# Altium project ac_rc_unit.PrjPcb
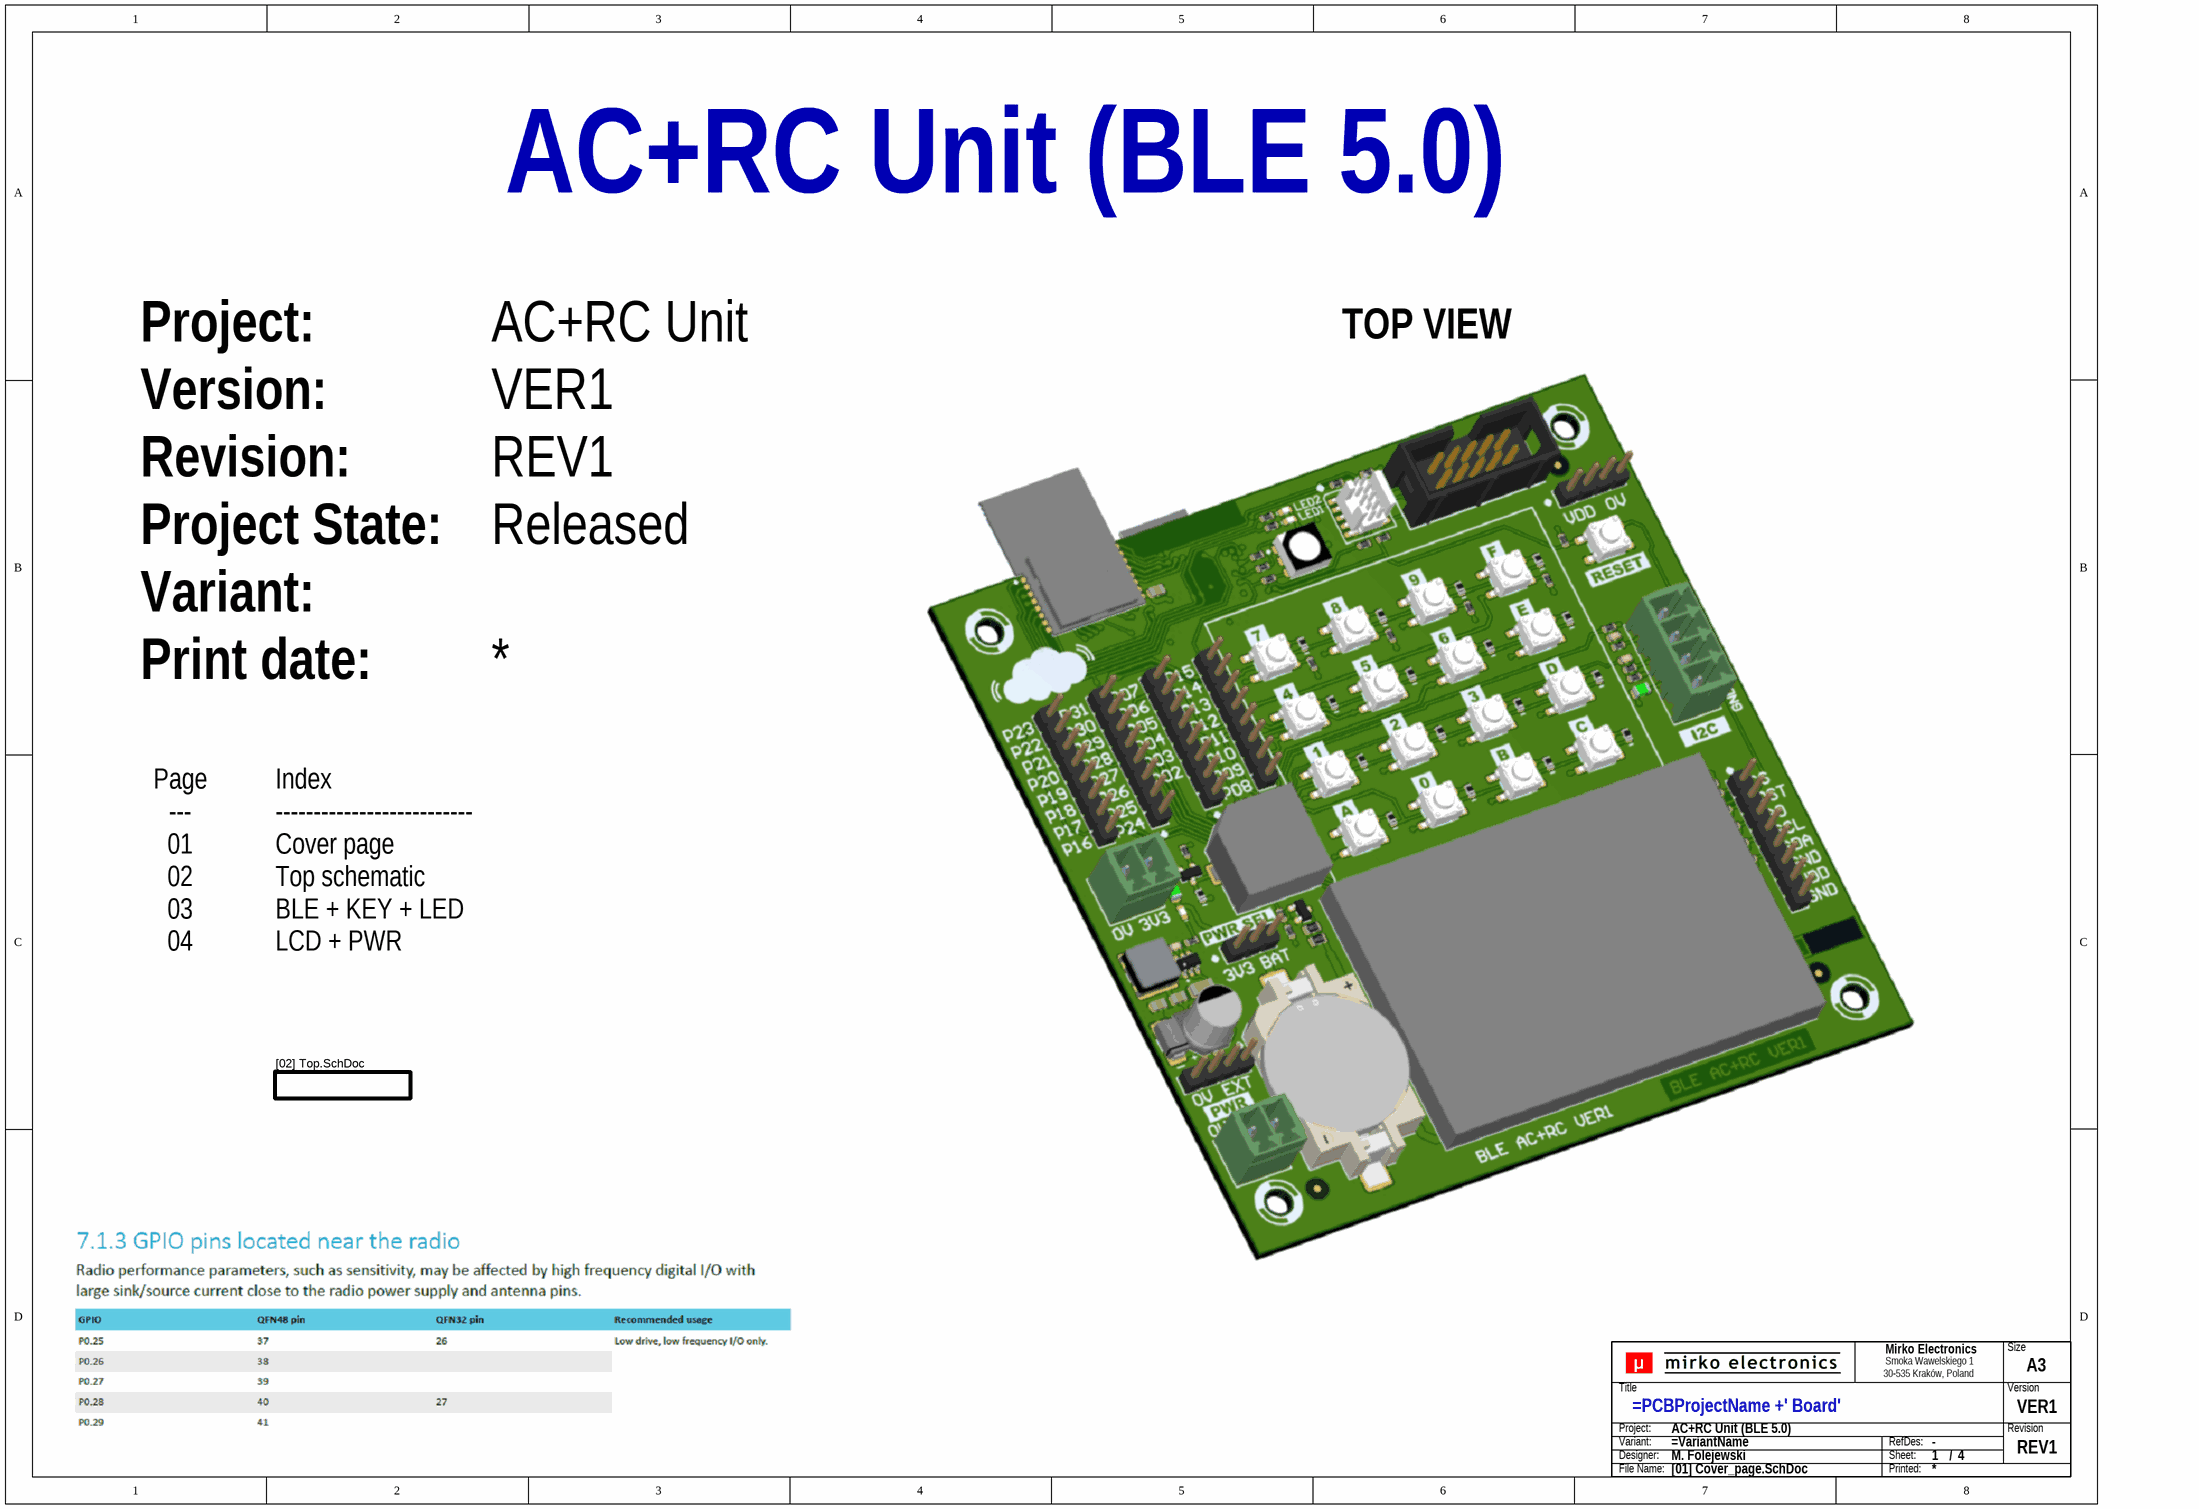
[diagram p0: [01] Cover_page.SchDoc]
GlobalProjectName: AC+RC Unit; GlobalProjectNumber: 2019upwork005; OutputFileNamePrefix: ac_rc_unit_VER1; PCBBoardName: AC+RC Unit; PCBProjectName: AC+RC Unit (BLE 5.0); SchPcbReleaseState: Released; SchPcbRevision: REV1; SchPcbVersion: VER1
4 sheets, 129 parts. Net scope: flat (ports and power ports of the same name join across sheets).
Board file: ac_rc_unit_VER1.PcbDoc
Sheets:
  [01] Cover_page.SchDoc
    D8 = [02] Top.SchDoc
      D7 = [03] BLE_KEY_LED.SchDoc
      D8 = [04] LCD_PWR.SchDoc

## Sheet [01] Cover_page.SchDoc: =PCBProjectName +' Board'
size A3; Engineer: M. Folejewski; DocumentNumber: 1; SheetNumber: 1; SheetTotal: 4; Designators: -; PageSize: A3

### Parts
(Parts that share a designator on the sheet are numbered #1, #2 ... from top to bottom, then left to right.)
TB?#1  Title block  (value not drawn)  (graphical)

### Sub-sheets
D8 = [02] Top.SchDoc: no entries

### Notes on the sheet
- Project:
- TOP VIEW
- Version:
- Revision:
- Project State:
- Variant:
- Print date:
- Page
  ---
  01
  02
  03
  04
- Index
  --------------------------
  Cover page
  Top schematic
  BLE + KEY + LED
  LCD + PWR
- (in symbol SCH_TITLE_BLOCK_V1) Mirko Electronics; Size; Smoka Wawelskiego 1; 30-535 Kraków, Poland; Title; Version; Project:; Revision; Variant:; RefDes:; Designer:; Sheet:; /; File Name:; Printed:

### Library data of the parts
TB?#1 = SCH_TITLE_BLOCK_V1: Component Type: Title block; Manufacturer: -; Mounting Type: Non component; MPN: -; Operating Temperature: -; Package: -; Specification: Title block; Value: Title block; Replacement: -; System: ?

## Sheet [02] Top.SchDoc: Top schematic
size A3; Engineer: M. Folejewski; DocumentNumber: 2; SheetNumber: 2; SheetTotal: 4; PageSize: A3; Designators: 1-99
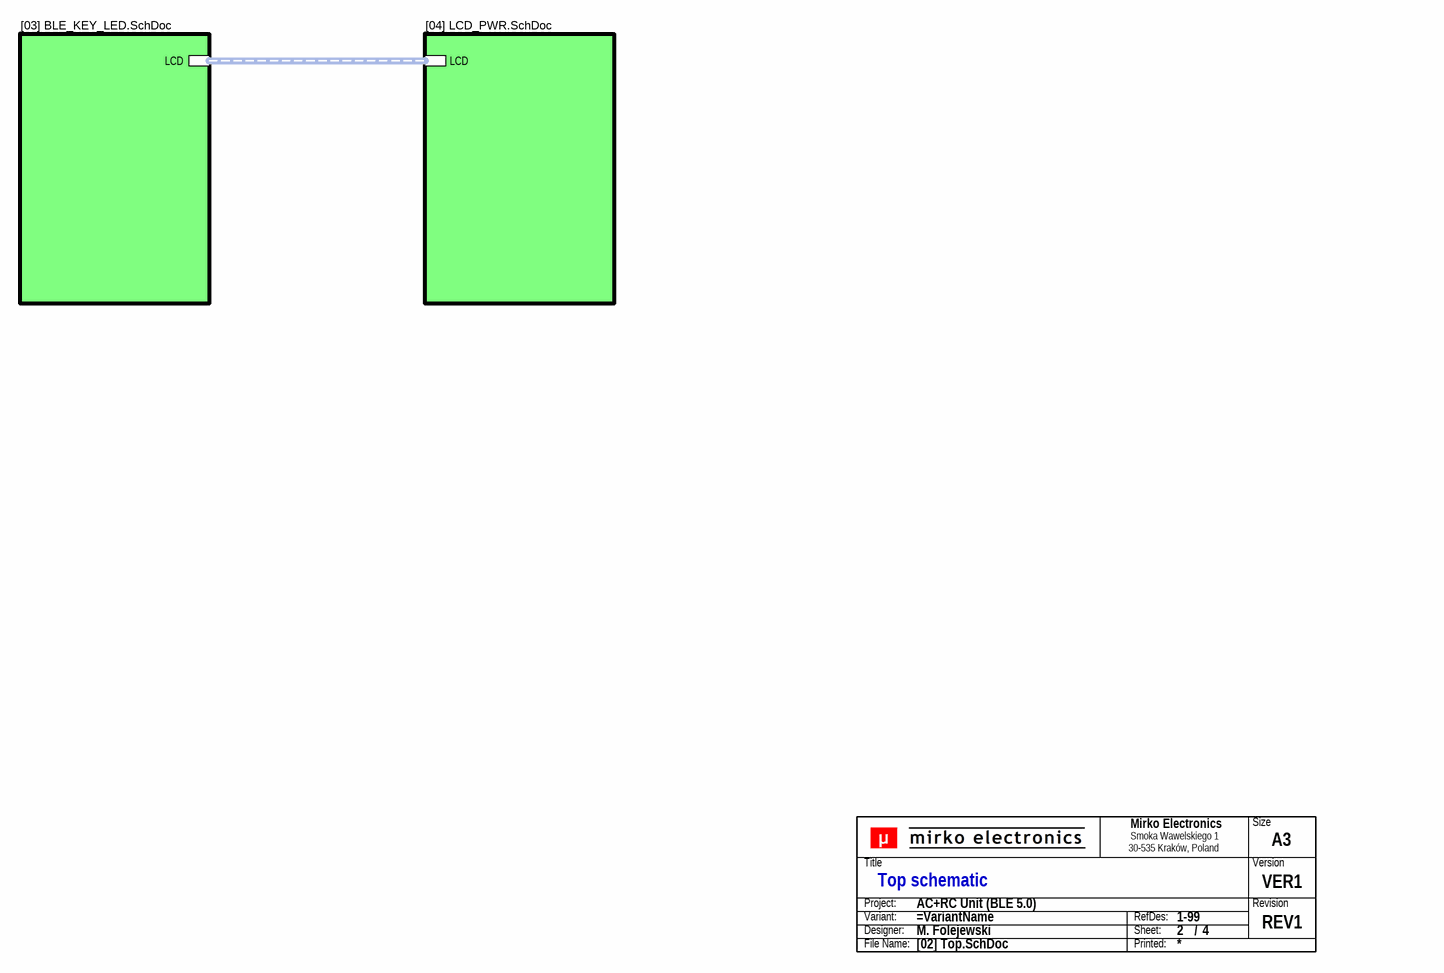
[diagram p1: [02] Top.SchDoc]

### Parts
(Parts that share a designator on the sheet are numbered #1, #2 ... from top to bottom, then left to right.)
TB?#2  Title block  (value not drawn)  (graphical)

### Sub-sheets
D7 = [03] BLE_KEY_LED.SchDoc: LCD (harness LCD)
D8 = [04] LCD_PWR.SchDoc: LCD (harness LCD)

### Buses and harness runs
harness sheet D7/LCD = sheet D8/LCD

### Notes on the sheet
- (in symbol SCH_TITLE_BLOCK_V1) Mirko Electronics; Size; Smoka Wawelskiego 1; 30-535 Kraków, Poland; Title; Version; Project:; Revision; Variant:; RefDes:; Designer:; Sheet:; /; File Name:; Printed:

### Library data of the parts
TB?#2 = SCH_TITLE_BLOCK_V1: Component Type: Title block; Manufacturer: -; Mounting Type: Non component; MPN: -; Operating Temperature: -; Package: -; Specification: Title block; Value: Title block; Replacement: -; System: ?

## Sheet [03] BLE_KEY_LED.SchDoc: BLE module, LEDs, keypad, buzzer
size A3; Engineer: M. Folejewski; DocumentNumber: 3; SheetNumber: 3; SheetTotal: 4; PageSize: A3; Designators: 1-99
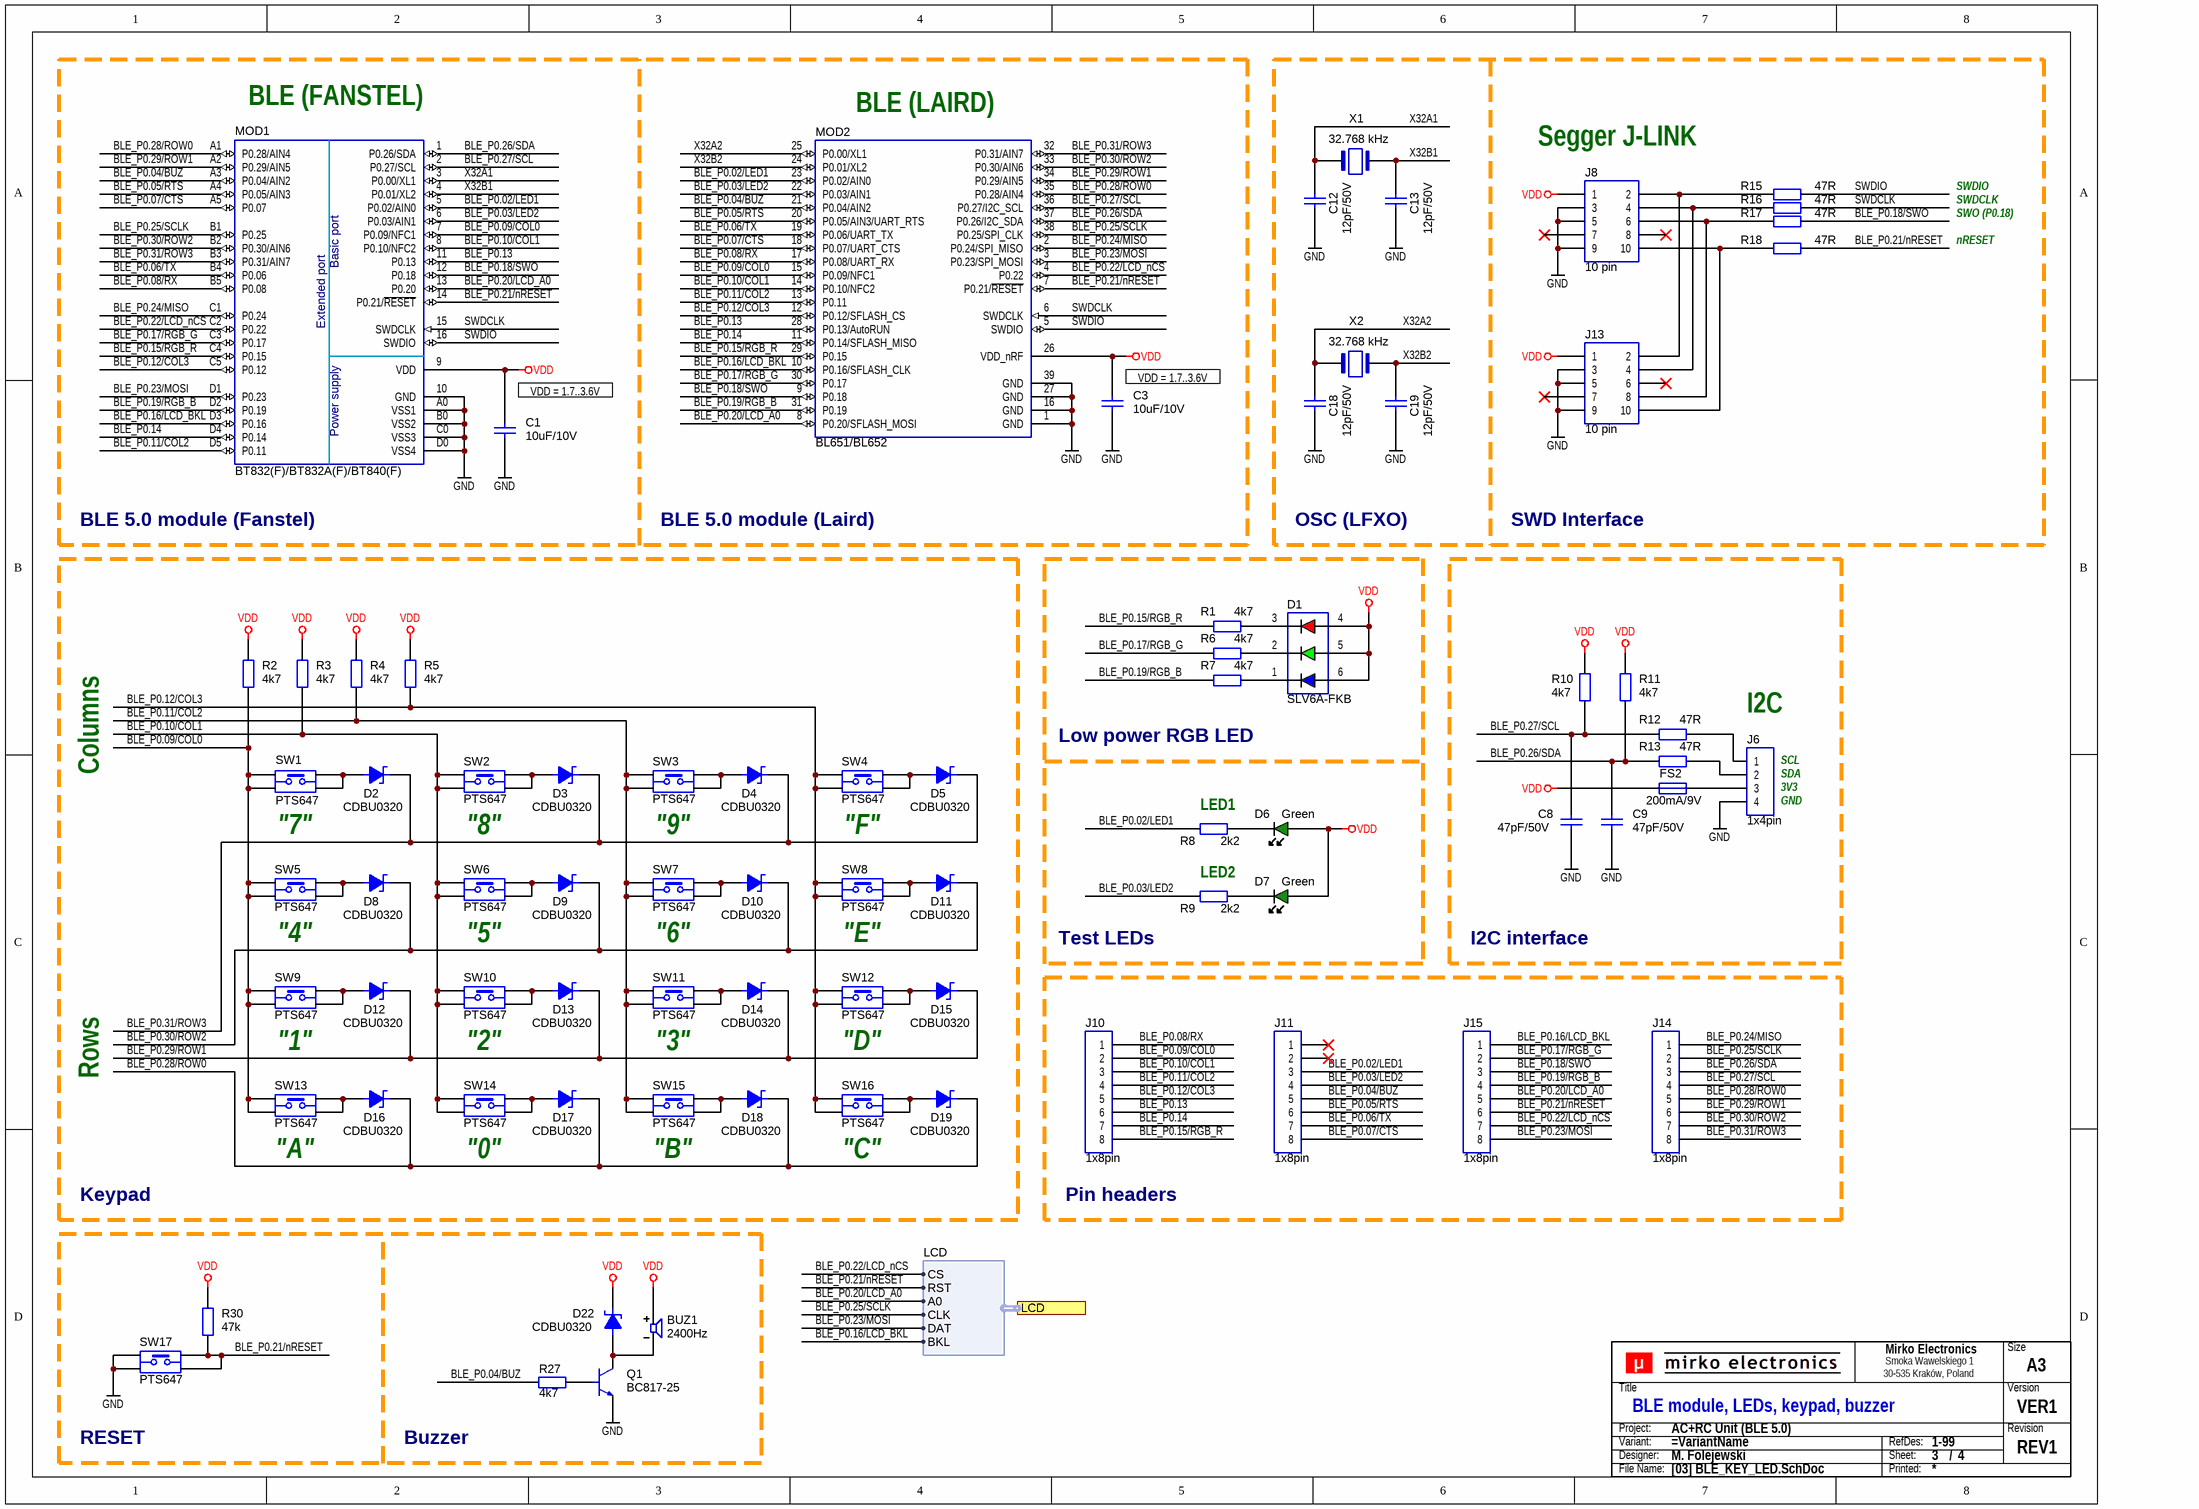
[diagram p2: [03] BLE_KEY_LED.SchDoc]

### Parts
(Parts that share a designator on the sheet are numbered #1, #2 ... from top to bottom, then left to right.)
BUZ1  2400Hz  [BUZ_LDT_SMB07]
C1  10uF/10V  [CAP_0805R]
C3  10uF/10V  [CAP_0805R]
C8  47pF/50V  [CAP_0603R]
C9  47pF/50V  [CAP_0603R]
C12  12pF/50V  [CAP_0603R]
C13  12pF/50V  [CAP_0603R]
C18  12pF/50V  [CAP_0603R]
C19  12pF/50V  [CAP_0603R]
D1  SLV6A-FKB  [LED_CRE_PLCC6_550_550]
D2  CDBU0320  [DIO_0603R]
D3  CDBU0320  [DIO_0603R]
D4  CDBU0320  [DIO_0603R]
D5  CDBU0320  [DIO_0603R]
D6  Green  [LED_0603R]
D7  Green  [LED_0603R]
D8  CDBU0320  [DIO_0603R]
D9  CDBU0320  [DIO_0603R]
D10  CDBU0320  [DIO_0603R]
D11  CDBU0320  [DIO_0603R]
D12  CDBU0320  [DIO_0603R]
D13  CDBU0320  [DIO_0603R]
D14  CDBU0320  [DIO_0603R]
D15  CDBU0320  [DIO_0603R]
D16  CDBU0320  [DIO_0603R]
D17  CDBU0320  [DIO_0603R]
D18  CDBU0320  [DIO_0603R]
D19  CDBU0320  [DIO_0603R]
D22  CDBU0320  [DIO_0603R]
FS2  200mA/9V  [FUS_ECE_SR0XX]
J6  1x4pin  [CON_WRT_691321100004]
J8  10 pin  [CON_SMT_FTSH-105-01-L-DV-K]
J10  1x8pin  [CON_HDR_P254_1X08]
J11  1x8pin  [CON_HDR_P254_1X08]
J13  10 pin  [CON_WRT_61201021621]
J14  1x8pin  [CON_HDR_P254_1X08]
J15  1x8pin  [CON_HDR_P254_1X08]
MOD1  BT832(F)/BT832A(F)/BT840(F)  [MOD_FNS_BT832_BT840_A/AF]
MOD2  BL651/BL652  [MOD_LRD_BL651_BL652]
Q1  BC817-25  [PKG_SOT23-3_TO236]
R1  4k7  [RES_0603R]
R2  4k7  [RES_0603R]
R3  4k7  [RES_0603R]
R4  4k7  [RES_0603R]
R5  4k7  [RES_0603R]
R6  4k7  [RES_0603R]
R7  4k7  [RES_0603R]
R8  2k2  [RES_0603R]
R9  2k2  [RES_0603R]
R10  4k7  [RES_0603R]
R11  4k7  [RES_0603R]
R12  47R  [RES_0603R]
R13  47R  [RES_0603R]
R15  47R  [RES_0603R]
R16  47R  [RES_0603R]
R17  47R  [RES_0603R]
R18  47R  [RES_0603R]
R27  4k7  [RES_0603R]
R30  47k  [RES_0603R]
SW1  PTS647  [SWI_CKS_PTS647Sx38]
SW2  PTS647  [SWI_CKS_PTS647Sx38]
SW3  PTS647  [SWI_CKS_PTS647Sx38]
SW4  PTS647  [SWI_CKS_PTS647Sx38]
SW5  PTS647  [SWI_CKS_PTS647Sx38]
SW6  PTS647  [SWI_CKS_PTS647Sx38]
SW7  PTS647  [SWI_CKS_PTS647Sx38]
SW8  PTS647  [SWI_CKS_PTS647Sx38]
SW9  PTS647  [SWI_CKS_PTS647Sx38]
SW10  PTS647  [SWI_CKS_PTS647Sx38]
SW11  PTS647  [SWI_CKS_PTS647Sx38]
SW12  PTS647  [SWI_CKS_PTS647Sx38]
SW13  PTS647  [SWI_CKS_PTS647Sx38]
SW14  PTS647  [SWI_CKS_PTS647Sx38]
SW15  PTS647  [SWI_CKS_PTS647Sx38]
SW16  PTS647  [SWI_CKS_PTS647Sx38]
SW17  PTS647  [SWI_CKS_PTS647Sx38]
TB?#3  Title block  (value not drawn)  (graphical)
X1  32.768 kHz  [OSC_EPS_FC-135]
X2  32.768 kHz  [OSC_EPS_FC-135]

### Ports
LCD (harness LCD)

### Harnesses
LCD: CS, RST, A0, CLK, DAT, BKL

### Nets
GND: C1.1 C3.1 C8.1 C9.1 C12.1 C13.1 C18.1 C19.1 J6.4 J8.3 J8.5 J8.9 J13.3 J13.5 J13.9 MOD1.10(GND) MOD1.A0(VSS1) MOD1.B0(VSS2) MOD1.C0(VSS3) MOD1.D0(VSS4) MOD2.1(GND) MOD2.16(GND) MOD2.27(GND) MOD2.39(GND) Q1.2(E) SW17.1 SW17.2
VDD: BUZ1.2 C1.2 C3.2 D1.4(AR) D1.5(AG) D1.6(AB) D6.2(A) D7.2(A) D22.1 FS2.1 J8.1 J13.1 MOD1.9(VDD) MOD2.26(VDD_nRF) R2.2 R3.2 R4.2 R5.2 R10.2 R11.2 R30.2
BLE_P0.02/LED1: J11.3 MOD1.5(P0.02/AIN0) MOD2.23(P0.02/AIN0) R8.2
BLE_P0.03/LED2: J11.4 MOD1.6(P0.03/AIN1) MOD2.22(P0.03/AIN1) R9.2
BLE_P0.04/BUZ: J11.5 MOD1.A3(P0.04/AIN2) MOD2.21(P0.04/AIN2) R27.2
BLE_P0.05/RTS: J11.6 MOD1.A4(P0.05/AIN3) MOD2.20(P0.05/AIN3/UART_RTS)
BLE_P0.06/TX: J11.7 MOD1.B4(P0.06) MOD2.19(P0.06/UART_TX)
BLE_P0.07/CTS: J11.8 MOD1.A5(P0.07) MOD2.18(P0.07/UART_CTS)
BLE_P0.08/RX: J10.1 MOD1.B5(P0.08) MOD2.17(P0.08/UART_RX)
BLE_P0.09/COL0: J10.2 MOD1.7(P0.09/NFC1) MOD2.15(P0.09/NFC1) R2.1 SW1.1 SW1.2 SW5.1 SW5.2 SW9.1 SW9.2 SW13.1 SW13.2
BLE_P0.10/COL1: J10.3 MOD1.8(P0.10/NFC2) MOD2.14(P0.10/NFC2) R3.1 SW2.1 SW2.2 SW6.1 SW6.2 SW10.1 SW10.2 SW14.1 SW14.2
BLE_P0.11/COL2: J10.4 MOD1.D5(P0.11) MOD2.13(P0.11) R4.1 SW3.1 SW3.2 SW7.1 SW7.2 SW11.1 SW11.2 SW15.1 SW15.2
BLE_P0.12/COL3: J10.5 MOD1.C5(P0.12) MOD2.12(P0.12/SFLASH_CS) R5.1 SW4.1 SW4.2 SW8.1 SW8.2 SW12.1 SW12.2 SW16.1 SW16.2
BLE_P0.13: J10.6 MOD1.11(P0.13) MOD2.28(P0.13/AutoRUN)
BLE_P0.14: J10.7 MOD1.D4(P0.14) MOD2.11(P0.14/SFLASH_MISO)
BLE_P0.15/RGB_R: J10.8 MOD1.C4(P0.15) MOD2.29(P0.15) R1.1
BLE_P0.16/LCD_BKL: J15.1 MOD1.D3(P0.16) MOD2.10(P0.16/SFLASH_CLK) ; port LCD.BKL
BLE_P0.17/RGB_G: J15.2 MOD1.C3(P0.17) MOD2.30(P0.17) R6.1
BLE_P0.18/SWO: J15.3 MOD1.12(P0.18) MOD2.9(P0.18) R17.1
BLE_P0.19/RGB_B: J15.4 MOD1.D2(P0.19) MOD2.31(P0.19) R7.1
BLE_P0.20/LCD_A0: J15.5 MOD1.13(P0.20) MOD2.8(P0.20/SFLASH_MOSI) ; port LCD.A0
BLE_P0.21/nRESET: J15.6 MOD1.14(P0.21/~{RESET}) MOD2.7(P0.21/~{RESET}) R18.1 R30.1 SW17.3 SW17.4 ; port LCD.RST
BLE_P0.22/LCD_nCS: J15.7 MOD1.C2(P0.22) MOD2.4(P0.22) ; port LCD.CS
BLE_P0.23/MOSI: J15.8 MOD1.D1(P0.23) MOD2.3(P0.23/SPI_MOSI) ; port LCD.DAT
BLE_P0.24/MISO: J14.1 MOD1.C1(P0.24) MOD2.2(P0.24/SPI_MISO)
BLE_P0.25/SCLK: J14.2 MOD1.B1(P0.25) MOD2.38(P0.25/SPI_CLK) ; port LCD.CLK
BLE_P0.26/SDA: C9.2 J14.3 MOD1.1(P0.26/SDA) MOD2.37(P0.26/I2C_SDA) R11.1 R13.2
BLE_P0.27/SCL: C8.2 J14.4 MOD1.2(P0.27/SCL) MOD2.36(P0.27/I2C_SCL) R10.1 R12.2
BLE_P0.28/ROW0: D16.1 D17.1 D18.1 D19.1 J14.5 MOD1.A1(P0.28/AIN4) MOD2.35(P0.28/AIN4)
BLE_P0.29/ROW1: D12.1 D13.1 D14.1 D15.1 J14.6 MOD1.A2(P0.29/AIN5) MOD2.34(P0.29/AIN5)
BLE_P0.30/ROW2: D8.1 D9.1 D10.1 D11.1 J14.7 MOD1.B2(P0.30/AIN6) MOD2.33(P0.30/AIN6)
BLE_P0.31/ROW3: D2.1 D3.1 D4.1 D5.1 J14.8 MOD1.B3(P0.31/AIN7) MOD2.32(P0.31/AIN7)
SWDCLK: MOD1.15(SWDCLK) MOD2.6(SWDCLK) R16.1
SWDIO: MOD1.16(SWDIO) MOD2.5(SWDIO) R15.1
X32A1: C12.2 MOD1.3(P0.00/XL1) X1.1
X32A2: C18.2 MOD2.25(P0.00/XL1) X2.1
X32B1: C13.2 MOD1.4(P0.01/XL2) X1.2
X32B2: C19.2 MOD2.24(P0.01/XL2) X2.2
NetBUZ1_1: BUZ1.1 D22.2 Q1.3(C)
NetD1_1: D1.1(CB) R7.2
NetD1_2: D1.2(CG) R6.2
NetD1_3: D1.3(CR) R1.2
NetD2_2: D2.2 SW1.3 SW1.4
NetD3_2: D3.2 SW2.3 SW2.4
NetD4_2: D4.2 SW3.3 SW3.4
NetD5_2: D5.2 SW4.3 SW4.4
NetD6_1: D6.1(K) R8.1
NetD7_1: D7.1(K) R9.1
NetD8_2: D8.2 SW5.3 SW5.4
NetD9_2: D9.2 SW6.3 SW6.4
NetD10_2: D10.2 SW7.3 SW7.4
NetD11_2: D11.2 SW8.3 SW8.4
NetD12_2: D12.2 SW9.3 SW9.4
NetD13_2: D13.2 SW10.3 SW10.4
NetD14_2: D14.2 SW11.3 SW11.4
NetD15_2: D15.2 SW12.3 SW12.4
NetD16_2: D16.2 SW13.3 SW13.4
NetD17_2: D17.2 SW14.3 SW14.4
NetD18_2: D18.2 SW15.3 SW15.4
NetD19_2: D19.2 SW16.3 SW16.4
NetFS2_2: FS2.2 J6.3
NetJ6_1: J6.1 R12.1
NetJ6_2: J6.2 R13.1
NetJ8_2: J8.2 J13.2 R15.2
NetJ8_4: J8.4 J13.4 R16.2
NetJ8_6: J8.6 J13.8 R17.2
NetJ8_10: J8.10 J13.10 R18.2
NetQ1_1: Q1.1(B) R27.1

Not connected (* = marked no-connect by the designer): J8 7* 8*; J11 1* 2*; J13 6* 7*

### Notes on the sheet
- (near MOD1) BLE (FANSTEL)
- (near MOD2) BLE (LAIRD)
- Segger J-LINK
- SWDIO
- SWDCLK
- nRESET
- SWO (P0.18)
- (near C3) VDD = 1.7..3.6V
- (near C1) VDD = 1.7..3.6V
- BLE 5.0 module (Fanstel)
- BLE 5.0 module (Laird)
- OSC (LFXO)
- SWD Interface
- I2C
- Columns
- Low power RGB LED
- (near J6) SDA
- (near J6) SCL
- (near SW1) "7"
- (near SW2) "8"
- (near SW3) "9"
- (near SW4) "F"
- (near R8) LED1
- (near J6) 3V3
- (near J6) GND
- (near R9) LED2
- (near SW5) "4"
- (near SW6) "5"
- (near SW7) "6"
- (near SW8) "E"
- Test LEDs
- I2C interface
- (near SW9) "1"
- (near SW10) "2"
- (near SW11) "3"
- (near SW12) "D"
- Rows
- (near SW13) "A"
- (near SW14) "0"
- (near SW15) "B"
- (near SW16) "C"
- Keypad
- (near J10) Pin headers
- RESET
- Buzzer
- (in symbol MOD_FNS_BT832_BT840_A/AF) Basic port; Extended port; Power supply
- (in symbol SCH_TITLE_BLOCK_V1) Mirko Electronics; Size; Smoka Wawelskiego 1; 30-535 Kraków, Poland; Title; Version; Project:; Revision; Variant:; RefDes:; Designer:; Sheet:; /; File Name:; Printed:

### Library data of the parts
BUZ1 = BUZ_LDT_LD-BZEL-B07-1212: Buzzer; Manufacturer: Loudity; Specification: Buzzer, internal generator, 2400Hz, 30mA, 85dB, SMD package; Replacement: NO; Component Type: Buzzer; Mounting Type: SMD; MPN: LD-BZEL-B07-1212; Operating Temperature: -30°C to +80°C; Package: SMD; Value: 2400Hz; System: ?
C1 C3 = CAP: Manufacturer: Murata Electronics; MPN: GRM21BR71A106KA73K; Specification: Capacitor, MLCC, 10uF, 10V, X7R, 10%, SMD 0805 (2012); Replacement: YES; Component Type: Capacitor; Mounting Type: SMD; Package: SMD 0805 (2012); Value: 10uF/10V; Operating Temperature: -55°C to +125°C
C8 C9 = CAP: Manufacturer: Yageo; MPN: CC0603JRNPO9BN470; Specification: Capacitor, MLCC, 47pF, 50V, C0G, 5%, SMD 0603 (1608); Replacement: YES; Component Type: Capacitor; Mounting Type: SMD; Package: SMD 0603 (1608); Value: 47pF/50V; Operating Temperature: -55°C to +125°C
C12 C13 C18 C19 = CAP: Manufacturer: AVX; MPN: 06035A120JAT2A; Specification: Capacitor, MLCC, 12pF, 50V, C0G, 5%, SMD 0603 (1608); Replacement: YES; Component Type: Capacitor; Mounting Type: SMD; Package: SMD 0603 (1608); Value: 12pF/50V; Operating Temperature: -55°C to +125°C
D1 = LED_CRE_SLV6A-FKB-CKNPRGJBB7a363: LED; Manufacturer: CREE; Replacement: YES; Specification: LED RGB diode, Red 560-1120 mcd, Green 1120-2240 mcd, Blue 280-560 mcd, PLCC6 package; Component Type: LED Diode; Mounting Type: SMD; MPN: SLV6A-FKB-CKNPRGJBB7a363; Operating Temperature: -40°C to +100°C; Package: SMD PLCC6; System: ?; Value: SLV6A-FKB
D2-D5 D8-D19 D22 = DIO_CMC_CDBU0320-HF: Diode; Manufacturer: Comchip Technology; Specification: Schottky Barrier Diode, 20V, 1.5A, SMD 0603 (1608) package; Replacement: YES; Component Type: Schottky Diode; Mounting Type: SMD; MPN: CDBU0320-HF; Operating Temperature: -40°C to +125°C; Package: SMD 0603 (1608); Value: CDBU0320; System: ?
D6 D7 = LED_WRT_150060VS55040: LED; Manufacturer: Wurth Elektronik; Replacement: YES; Specification: LED diode, green, 575nm, 60mcd, 140deg, 0603 package; Component Type: LED Diode; Mounting Type: SMD; MPN: 150060VS55040; Operating Temperature: -40°C to +85°C; Package: SMD 0603 (1608); System: ?; Value: Green
FS2 = FUS_ECE_SR0XX: Fuse; Manufacturer: ECE; MPN: SR020-09; Specification: Polymer fuse, 200mA, 9V, SMD 0805 (2012) package; Replacement: YES; Component Type: Polymer fuse; Mounting Type: SMD; Operating Temperature: -40°C to +85°C; Package: SMD 0805 (2012); Value: 200mA/9V; System: ?
J6 = CON_HDR_WRT_61300411121: CON; Manufacturer: Wurth Elektronik GmbH; MPN: 691321100004; Specification: Connector, terminal block, 1x4 pin, 3.50 pitch, vertical, THT package; Replacement: YES; Component Type: Connector; Mounting Type: THT; Operating Temperature: -40°C to +105°C; Package: THT; Value: 1x4pin; System: ?
J8 = Conn_2x5pin: Connector, 2x5 pin; Manufacturer: Samtec; MPN: FTSH-105-01-L-DV-K; Specification: Precision pin header, 1.27mm pitch, 10 pin, straight, male, double row, gold plated, SMD package; Replacement: YES; Component Type: Connector; Mounting Type: SMD; Operating Temperature: -55°C to +125°C; Package: SMD, 1.27mm pitch; Value: 10 pin; System: ?
J10 J11 J14 J15 = CON_HDR_1X08: Connector, 8pin; Manufacturer: Wurth Elektronik GmbH; MPN: 61300811121; Specification: Connector, pin header, 1x8 pin, single row, 2.54 pitch, straight pin, THT package; Replacement: YES; Component Type: Connector; Mounting Type: THT; Operating Temperature: -40°C to +125°C; Package: THT; Value: 1x8pin; System: ?
J13 = CON_HDR_2X05: Connector, 2x5pin; Manufacturer: Wurth Elektronik GmbH; MPN: 61201021621; Specification: Precision pin header, 2.54mm pitch, 10 pin, straight, male, double row, gold plated, THT package; Replacement: YES; Component Type: Connector; Mounting Type: THT; Operating Temperature: -55°C to +125°C; Package: THT, 2.54mm pitch; Value: 10 pin; System: ?
MOD1 = MOD_FNS_BT832_BT840_A/AF: PCB Module; Manufacturer: Fanstel Corp.; Replacement: YES; Specification: Bluetooth 5.0 + NFC module, Nordic nRF52810/nRF52832 QFN48, 192/512kB Flash + 24/64kB RAM, 14x16x1.9mm SMD package; Component Type: PCB Module; Mounting Type: SMD; MPN: BT832(F)/BT832A(F)/BT840(F); Operating Temperature: -40°C to +85°C; Package: PCB Module; System: ?; Value: BT832(F)/BT832A(F)/BT840(F)
MOD2 = MOD_LRD_BL651_BL652: PCB Module; Manufacturer: Laird Connectivity; Replacement: YES; Specification: Bluetooth 5.0 + NFC module, Nordic nRF52810/nRF52832 QFN48, 192/512kB Flash + 24/64kB RAM, 14x10x2.1mm SMD package; Component Type: PCB Module; Mounting Type: SMD; MPN: BL651/BL652; Operating Temperature: -40°C to +85°C; Package: PCB Module; System: ?; Value: BL651/BL652
Q1 = NPN_Transistor: NPN Transistor; Manufacturer: Nexperia (NXP); MPN: BC817-25,215; Specification: Bipolar transistor, NPN, 45V, 500mA; Replacement: YES; Component Type: Transistor; Mounting Type: SMD; Package: SOT23-3; Value: BC817-25; Operating Temperature: -65°C to +150°C
R1-R7 R10 R11 R27 = RES: Manufacturer: Yageo; MPN: RC0603FR-074K7L; Specification: Resistor, 4.7k, 1%, SMD 0603; Replacement: YES; Component Type: Resistor; Mounting Type: SMD; Package: SMD 0603 (1608); Value: 4k7; Operating Temperature: -55°C to +155°C; System: ?
R8 R9 = RES: Manufacturer: Yageo; MPN: RC0603FR-072K2L; Specification: Resistor, 2.2k, 1%, SMD 0603; Replacement: YES; Component Type: Resistor; Mounting Type: SMD; Package: SMD 0603 (1608); Value: 2k2; Operating Temperature: -55°C to +155°C
R12 R13 R15-R18 = RES: Manufacturer: Yageo; MPN: RC0603FR-0747RL; Specification: Resistor, 47R, 1%, SMD 0603 (1608); Replacement: YES; Component Type: Resistor; Mounting Type: SMD; Package: SMD 0603 (1608); Value: 47R; Operating Temperature: -55°C to +155°C
R30 = RES: Manufacturer: Yageo; MPN: RC0603FR-0747KL; Specification: Resistor, 47k, 1%, SMD 0603; Replacement: YES; Component Type: Resistor; Mounting Type: SMD; Package: SMD 0603 (1608); Value: 47k; Operating Temperature: -55°C to +155°C; System: ?
SW1-SW17 = SWI_CKS_PTS647SM38SMTR2LFS: Switch; Manufacturer: C&K Switches; Replacement: YES; Specification: Tactile switch, 50mA, 12VDC, 1.8N force, 3.8mm height, 3.0mm pitch, 4.5mm x 4.5mm size, SMD package; Component Type: Switch; Mounting Type: SMD; MPN: PTS647SM38SMTR2LFS; Operating Temperature: -20°C to +70°C; Package: SMD; System: ?; Value: PTS647
TB?#3 = SCH_TITLE_BLOCK_V1: Component Type: Title block; Manufacturer: -; Mounting Type: Non component; MPN: -; Operating Temperature: -; Package: -; Specification: Title block; Value: Title block; Replacement: -; System: ?
X1 X2 = XTAL_EPS_FC-135_32.7680KA-A: XTAL; Manufacturer: Seiko Epson Corp.; MPN: FC-135 32.7680KA-A; Specification: Crystal, 32.768 kHz, 20ppm, 12.5pF, SMD 3.2x1.5x0.8mm package; Replacement: YES; Component Type: Crystal; Mounting Type: SMD; Operating Temperature: -40°C to +85°C; Package: SMD 3.2x1.5x0.8mm; Value: 32.768 kHz; System: ?

## Sheet [04] LCD_PWR.SchDoc: LCD display, power supply
size A3; Engineer: M. Folejewski; DocumentNumber: 4; SheetNumber: 4; SheetTotal: 4; PageSize: A3; Designators: 1-99
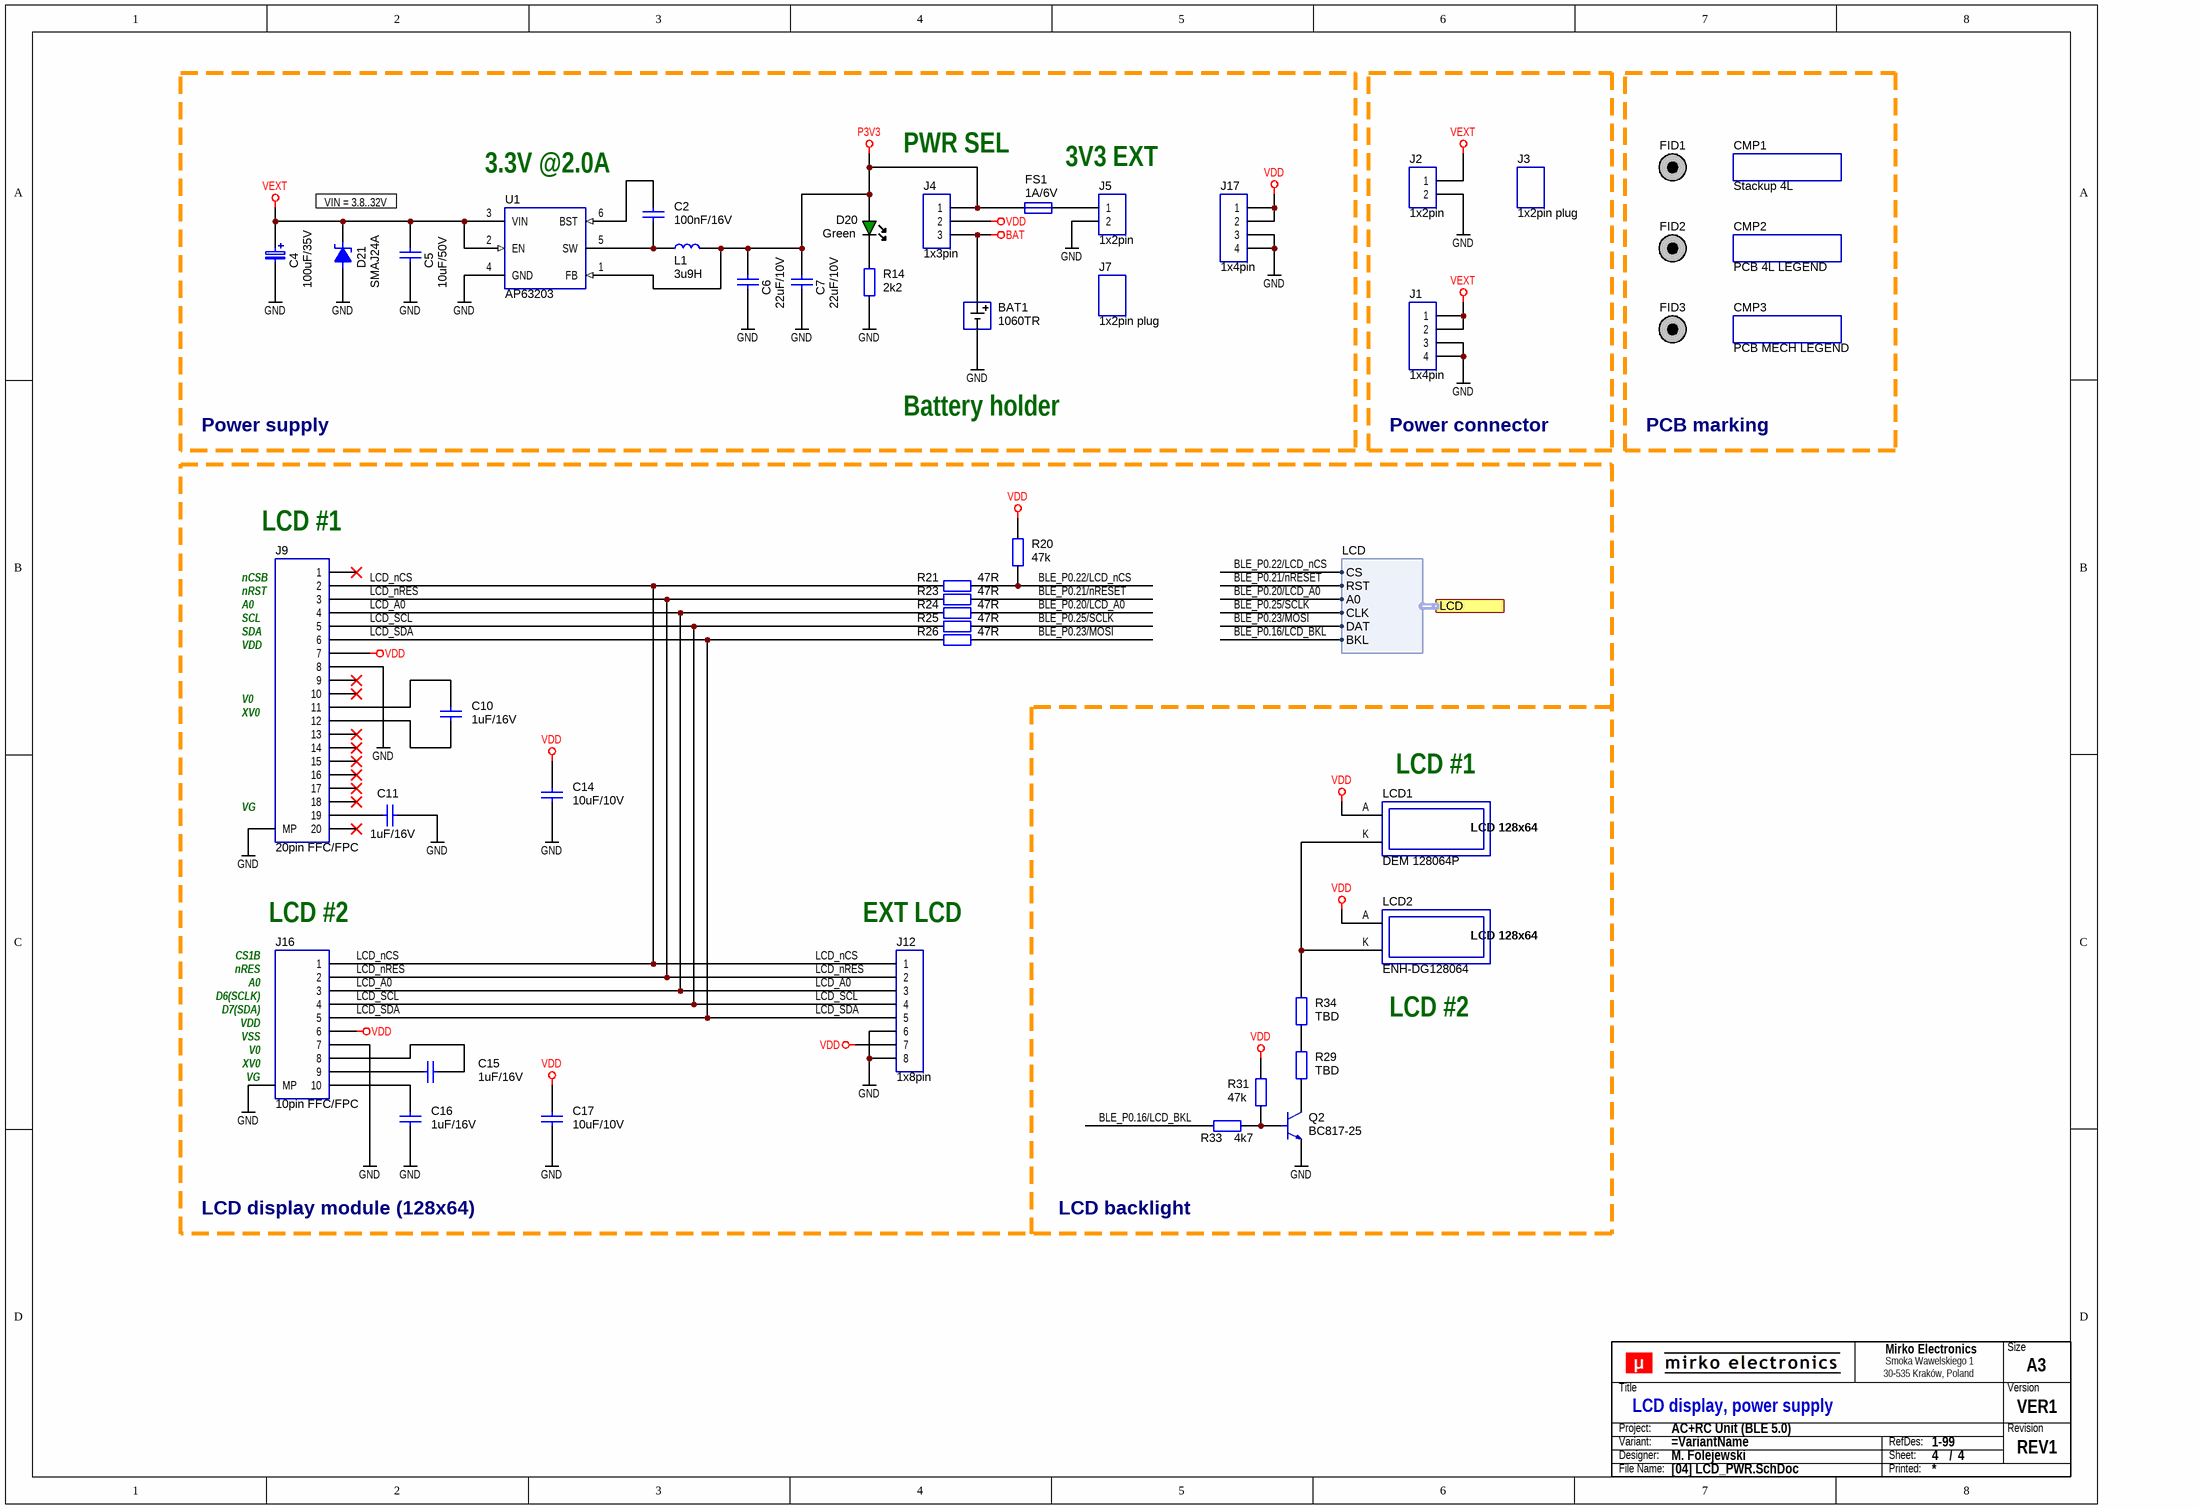
[diagram p3: [04] LCD_PWR.SchDoc]

### Parts
(Parts that share a designator on the sheet are numbered #1, #2 ... from top to bottom, then left to right.)
BAT1  1060TR  [BAT_KEY_1060]
C2  100nF/16V  [CAP_0603R]
C4  100uF/35V  [CAP_SMD_SIZE_D8]
C5  10uF/50V  [CAP_1206R]
C6  22uF/10V  [CAP_0805R]
C7  22uF/10V  [CAP_0805R]
C10  1uF/16V  [CAP_0805R]
C11  1uF/16V  [CAP_0805R]
C14  10uF/10V  [CAP_0805R]
C15  1uF/16V  [CAP_0805R]
C16  1uF/16V  [CAP_0805R]
C17  10uF/10V  [CAP_0805R]
CMP1  Stackup 4L  [PCB_STACKUP-4L]  (no BOM)
CMP2  PCB 4L LEGEND  [PCB_LAYER_LEGEND_4L]  (no BOM)
CMP3  PCB MECH LEGEND  [PCB_LAYER_LEGEND_MECH01-08_SET]  (no BOM)
D20  Green  [LED_0603R]
D21  SMAJ24A  [DIO_SMA_R]
FID1  Fiducial  [PCB_FID_RND_100x300]  (value not drawn)  (no BOM)
FID2  Fiducial  [PCB_FID_RND_100x300]  (value not drawn)  (no BOM)
FID3  Fiducial  [PCB_FID_RND_100x300]  (value not drawn)  (no BOM)
FS1  1A/6V  [FUS_ECE_SR0XX]
J1  1x4pin  [CON_HDR_P254_1X04]
J2  1x2pin  [CON_WRT_691321100002]
J3  1x2pin plug  (mechanical)
J4  1x3pin  [CON_HDR_P254_1X03]
J5  1x2pin  [CON_WRT_691321100002]
J7  1x2pin plug  (mechanical)
J9  20pin FFC/FPC  [CON_WRT_68712014522]
J12  1x8pin  [CON_HDR_P254_1X08]
J16  10pin FFC/FPC  [CON_WRT_686110183422_REV]
J17  1x4pin  [CON_HDR_P254_1X04]
L1  3u9H  [IND_BRS_SRN6028]
LCD1  DEM 128064P  [LCD_DEL_DEM128064P_FGH-PW_A2]
LCD2  ENH-DG128064  [LCD_SEE_ENH-DG128064-148-YFPTGF_A2]
Q2  BC817-25  [PKG_SOT23-3_TO236]
R14  2k2  [RES_0603R]
R20  47k  [RES_0603R]
R21  47R  [RES_0603R]
R23  47R  [RES_0603R]
R24  47R  [RES_0603R]
R25  47R  [RES_0603R]
R26  47R  [RES_0603R]
R29  TBD  [RES_0805R]
R31  47k  [RES_0603R]
R33  4k7  [RES_0603R]
R34  TBD  [RES_0805R]
TB?#4  Title block  (value not drawn)  (graphical)
U1  AP63203  [ICC_TSOT26]

### Ports
LCD (harness LCD)

### Harnesses
LCD: CS, RST, A0, CLK, DAT, BKL

### Nets
BAT: BAT1.2 J4.3
GND: BAT1.1 C4.1 C5.1 C6.2 C7.2 C11.2 C14.1 C16.2 C17.1 D21.2 J1.3 J1.4 J2.2 J5.2 J9.0(MP) J9.8 J12.6 J12.8 J16.0(MP) J16.7 J17.3 J17.4 Q2.2(E) R14.2 U1.4(GND)
P3V3: C6.1 C7.1 D20.2(A) FS1.1 J4.1 L1.2 U1.1(FB)
VDD: C14.2 C17.2 J4.2 J9.7 J12.7 J16.6 J17.1 J17.2 LCD1.A LCD2.A R20.2 R31.2
VEXT: C4.2 C5.2 D21.1 J1.1 J1.2 J2.1 U1.2(EN) U1.3(VIN)
BLE_P0.16/LCD_BKL: R33.2 ; port LCD.BKL
BLE_P0.20/LCD_A0: R24.1 ; port LCD.A0
BLE_P0.21/nRESET: R23.1 ; port LCD.RST
BLE_P0.22/LCD_nCS: R20.1 R21.1 ; port LCD.CS
BLE_P0.23/MOSI: R26.1 ; port LCD.DAT
BLE_P0.25/SCLK: R25.1 ; port LCD.CLK
LCD_A0: J9.4 J12.3 J16.3 R24.2
LCD_nCS: J9.2 J12.1 J16.1 R21.2
LCD_nRES: J9.3 J12.2 J16.2 R23.2
LCD_SCL: J9.5 J12.4 J16.4 R25.2
LCD_SDA: J9.6 J12.5 J16.5 R26.2
NetC2_1: C2.1 L1.1 U1.5(SW)
NetC2_2: C2.2 U1.6(BST)
NetC10_1: C10.1 J9.12
NetC10_2: C10.2 J9.11
NetC11_1: C11.1 J9.19
NetC15_1: C15.1 J16.8
NetC15_2: C15.2 J16.9
NetC16_1: C16.1 J16.10
NetD20_1: D20.1(K) R14.1
NetFS1_2: FS1.2 J5.1
NetLCD1_K: LCD1.K LCD2.K R34.2
NetQ2_1: Q2.1(B) R31.1 R33.1
NetQ2_3: Q2.3(C) R29.2
NetR29_1: R29.1 R34.1

Not connected (* = marked no-connect by the designer): J9 1* 9* 10* 13* 14* 15* 16* 17* 18* 20*

### Notes on the sheet
- 3.3V @2.0A
- PWR SEL
- 3V3 EXT
- VIN = 3.8..32V
- Power supply
- Battery holder
- Power connector
- PCB marking
- (near J9) nCSB
- (near J9) LCD #1
- (near J9) VDD
- (near J9) nRST
- (near J9) A0
- (near J9) SCL
- (near J9) SDA
- (near J9) V0
- (near J9) XV0
- (near LCD1) LCD #1
- (near J9) VG
- (near J16) CS1B
- (near J16) nRES
- (near J16) A0
- (near J16) LCD #2
- (near J12) EXT LCD
- (near J16) D6(SCLK)
- (near J16) D7(SDA)
- (near J16) VDD
- (near J16) VSS
- (near J16) V0
- (near LCD2) LCD #2
- (near J16) XV0
- (near J16) VG
- LCD display module (128x64)
- LCD backlight
- (in symbol LCD_DEL_DEM128064P_FGH-PW) LCD 128x64
- (in symbol LCD_SEE_ENH-DG128064-148-YFPTGF) LCD 128x64
- (in symbol SCH_TITLE_BLOCK_V1) Mirko Electronics; Size; Smoka Wawelskiego 1; 30-535 Kraków, Poland; Title; Version; Project:; Revision; Variant:; RefDes:; Designer:; Sheet:; /; File Name:; Printed:

### Library data of the parts
BAT1 = BAT_KEY_1060: BAT; Manufacturer: Keystone Electronics Corp.; Specification: Battery holder, CR2025/CR2032, SMD package; Component Type: Battery holder; Mounting Type: SMD; MPN: 1060TR; Operating Temperature: -xx°C to +xx°C; Package: SMD; Value: 1060TR; Replacement: ?; System: ?
C2 = CAP: Manufacturer: Yageo; MPN: CC0603KRX7R7BB104; Specification: Capacitor, 100nF, 16V, X7R, 10%, SMD 0603; Replacement: YES; Component Type: Capacitor; Mounting Type: SMD; Package: SMD 0603 (1608); Value: 100nF/16V; Operating Temperature: -55°C to +125°C; System: ?
C4 = ELCAP_SMD: ELCAP SMD; Manufacturer: Panasonic; MPN: EEEFK1V101XP; Specification: Electrolytic capacitor, 100uF, 35V, ±20%, 2000h @ 105°C, low impedance, SMD size D8 package; Replacement: YES; Component Type: Electrolytic capacitor; Mounting Type: SMD; Operating Temperature: -55°C to +105°C; Package: SMD size D8 (6.6x6.6mm); Value: 100uF/35V
C5 = CAP: Manufacturer: Taiyo Yuden; MPN: UMK316BBJ106KL-T; Specification: Capacitor, MLCC, 10uF, 50V, X5R, 10%, SMD 1206 (3216); Replacement: YES; Component Type: Capacitor; Mounting Type: SMD; Package: SMD 1206 (3216); Value: 10uF/50V; Operating Temperature: -55°C to +85°C
C6 C7 = CAP: Manufacturer: Taiyo Yuden; MPN: LMK212BBJ226MG-T; Specification: Capacitor, MLCC, 22uF, 10V, X5R, 20%, SMD 0805 (2012); Replacement: YES; Component Type: Capacitor; Mounting Type: SMD; Package: SMD 0805 (2012); Value: 22uF/10V; Operating Temperature: -55°C to +85°C; System: ?
C10 C11 C15 C16 = CAP: Manufacturer: Taiyo Yuden; MPN: EMK212B7105MG-T; Specification: Capacitor, MLCC, 1uF, 16V, X7R, 20%, SMD 0805 (2012); Replacement: YES; Component Type: Capacitor; Mounting Type: SMD; Package: SMD 0805 (2012); Value: 1uF/16V; Operating Temperature: -55°C to +125°C; System: ?
C14 C17 = CAP: as C1 on sheet [03] BLE_KEY_LED; Component Type: Capacitor; Mounting Type: SMD; Package: SMD 0805 (2012); Value: 10uF/10V; Operating Temperature: -55°C to +125°C
CMP1 = NonComponent: Specification: Stackup legend indicator, 8layer PCB; Component Type: Graphical; FT Item: -; Manufacturer: -; Mounting Type: Non component; MPN: -; Package: -; Value: Stackup 4L; Operating Temperature: -; Replacement: N/A
CMP2 = NonComponent: Specification: 4-Layer PCB legend information table; Component Type: Graphical; FT Item: -; Manufacturer: -; Mounting Type: Non component; MPN: -; Package: -; Value: PCB 4L LEGEND; Operating Temperature: -; Replacement: N/A
CMP3 = NonComponent: Specification: Legend information table for PCB Mechanical layers; Component Type: Graphical; FT Item: -; Manufacturer: -; Mounting Type: Non component; MPN: -; Package: -; Value: PCB MECH LEGEND; Operating Temperature: -; Replacement: N/A
D20 = LED_WRT_150060VS55040: as D6 on sheet [03] BLE_KEY_LED; Component Type: LED Diode; Mounting Type: SMD; MPN: 150060VS55040; Operating Temperature: -40°C to +85°C; Package: SMD 0603 (1608); System: ?; Value: Green
D21 = DIO_DDS_SMAJ24A-13-F: Diode; Manufacturer: Diodes Incorporated; Specification: TVS Diode, unidirectional, 24V, 400W, DO-214AC (SMA) package; Replacement: YES; Component Type: TVS Diode; Mounting Type: SMD; MPN: SMAJ24A-13-F; Operating Temperature: -55°C to +150°C; Package: DO-214AC (SMA); Value: SMAJ24A; System: ?
FID1-FID3 = Fiducial: Specification: Fiducial, round, 1.5x3.0mm; Component Type: Fiducial; FT Item: -; Manufacturer: -; Mounting Type: Non component; MPN: -; Package: -; Value: Fiducial; Operating Temperature: -; Replacement: N/A
FS1 = FUS_ECE_SR0XX: Fuse; Manufacturer: Bel Fuse; MPN: 0ZCK0100FF2E; Specification: Polymer fuse, 1A, 6V, SMD 0805 (2012) package; Replacement: YES; Component Type: Polymer fuse; Mounting Type: SMD; Operating Temperature: -40°C to +85°C; Package: SMD 0805 (2012); Value: 1A/6V; System: ?
J1 J17 = CON_HDR_WRT_61300411121: CON; Manufacturer: Wurth Elektronik GmbH; Specification: Connector, pin header, 1x4 pin, single row, 2.54 pitch, straight pin, THT package; Replacement: YES; Component Type: Connector; Mounting Type: THT; MPN: 61300411121; Operating Temperature: -40°C to +125°C; Package: THT; Value: 1x4pin; System: ?
J2 J5 = CON_HDR_WRT_691321100002: Connector; Manufacturer: Wurth Elektronik GmbH; Specification: Connector, terminal block, 1x2 pin, 3.50 pitch, vertical, THT package; Replacement: YES; Component Type: Connector; Mounting Type: THT; MPN: 691321100002; Operating Temperature: -40°C to +105°C; Package: THT; Value: 1x2pin; System: ?
J3 J7 = CON_HDR_WRT_691363110002: Connector; Manufacturer: Wurth Elektronik GmbH; Specification: Connector, terminal block plug, 1x2 pin, 3.50 pitch, vertical, THT package; Replacement: YES; Component Type: Connector; Mounting Type: THT; MPN: 691363110002; Operating Temperature: -40°C to +105°C; Package: THT; Value: 1x2pin plug; System: ?
J4 = CON_HDR_WRT_61300311121: Connector; Manufacturer: Wurth Elektronik GmbH; Specification: Connector, pin header, 1x3 pin, single row, 2.54 pitch, straight pin, THT package; Replacement: YES; Component Type: Connector; Mounting Type: THT; MPN: 61300311121; Operating Temperature: -40°C to +125°C; Package: THT; Value: 1x3pin; System: ?
J9 = CON_WRT_68712014522: Connector; Manufacturer: Wurth Elektronik GmbH; Specification: WR-FPC SMT ZIF Horizontal, bottom contact, 0.50 mm pitch, 20pin, SMD package; Replacement: YES; Component Type: Connector; Mounting Type: SMD; MPN: 68712014522; Operating Temperature: -25°C to +85°C; Package: SMD FFC/FPC; Value: 20pin FFC/FPC; System: ?
J12 = CON_HDR_1X08: as J10 on sheet [03] BLE_KEY_LED; Component Type: Connector; Mounting Type: THT; Operating Temperature: -40°C to +125°C; Package: THT; Value: 1x8pin; System: ?
J16 = CON_WRT_686110183422: Connector; Manufacturer: Wurth Elektronik GmbH; Specification: WR-FPC SMT ZIF Horizontal, top contacts, 1.00 mm pitch, 10 pin, SMD package; Replacement: YES; Component Type: Connector; Mounting Type: SMD; MPN: 686110183422; Operating Temperature: -25°C to +85°C; Package: SMD FFC/FPC; Value: 10pin FFC/FPC; System: ?
L1 = IND: Manufacturer: Bourns; MPN: SRN6028-3R9M; Specification: Semi-shielded power inductor, 3.9uH, Isat 2.7A, DCR 38mOhm, SRN6028 series, SMD 6.0x6.0x2.8mm package; Replacement: YES; Component Type: Inductor; Mounting Type: SMD; Operating Temperature: -40°C to +125°C; Package: SMD 6.0x6.0x2.8mm; Value: 3u9H
LCD1 = LCD_DEL_DEM128064P_FGH-PW: LCD display; Manufacturer: Display Elektronik; MPN: DEM 128064P FGH-PW; Replacement: NO; Specification: Graphic LCD display, 128x64 pix., FSTN positive, white backlight, 37x30.3x7.1mm, ST7567 controller, THT package; Component Type: LCD display; Mounting Type: THT; Operating Temperature: -20°C to +70°C; Package: THT, 37x30.3mm; System: ?; Value: DEM 128064P
LCD2 = LCD_SEE_ENH-DG128064-148-YFPTGF: LCD display; Manufacturer: Shenzhen Enrich Electronics; Replacement: NO; Specification: Graphic LCD display, 128x64 pix., FSTN negative, white backlight, 56.60x38.60x5.10mm, ST7567 controller, THT package; Component Type: LCD display; Mounting Type: THT; MPN: ENH-DG128064-148-YFPTGF; Operating Temperature: -20°C to +70°C; Package: THT, 56.6x38.6mm; System: ?; Value: ENH-DG128064
Q2 = NPN_Transistor: as Q1 on sheet [03] BLE_KEY_LED; Component Type: Transistor; Mounting Type: SMD; Package: SOT23-3; Value: BC817-25; Operating Temperature: -65°C to +150°C
R14 = RES: as R8 on sheet [03] BLE_KEY_LED; Component Type: Resistor; Mounting Type: SMD; Package: SMD 0603 (1608); Value: 2k2; Operating Temperature: -55°C to +155°C
R20 R31 = RES: as R30 on sheet [03] BLE_KEY_LED; Component Type: Resistor; Mounting Type: SMD; Package: SMD 0603 (1608); Value: 47k; Operating Temperature: -55°C to +155°C; System: ?
R21 R23-R26 = RES: as R12 on sheet [03] BLE_KEY_LED; Component Type: Resistor; Mounting Type: SMD; Package: SMD 0603 (1608); Value: 47R; Operating Temperature: -55°C to +155°C
R29 R34 = RES: Manufacturer: Yageo; Specification: Resistor, TBD, 1%, SMD 0805 (2012); Replacement: YES; Component Type: Resistor; Mounting Type: SMD; MPN: TBD; Package: SMD 0805 (2012); Value: TBD; Operating Temperature: -55°C to +155°C
R33 = RES: as R1 on sheet [03] BLE_KEY_LED; Component Type: Resistor; Mounting Type: SMD; Package: SMD 0603 (1608); Value: 4k7; Operating Temperature: -55°C to +155°C; System: ?
TB?#4 = SCH_TITLE_BLOCK_V1: Component Type: Title block; Manufacturer: -; Mounting Type: Non component; MPN: -; Operating Temperature: -; Package: -; Specification: Title block; Value: Title block; Replacement: -; System: ?
U1 = ICC_DDS_AP63203WU-7: ICC; Manufacturer: Diodes Incorporated; Specification: Synchronous buck converter with enhanced EMI reduction, VOUT 3.3V, VIN 3.8V - 32V, 2A, 1.1MHz, TSOT26 package; Component Type: IC; Mounting Type: SMD; MPN: AP63203WU-7; Operating Temperature: -40°C to +85°C; Package: TSOT26; Value: AP63203; Replacement: ?; System: ?

## Nets that join several sheets
GND: [03] BLE_KEY_LED (27 pins), [04] LCD_PWR (25 pins)
VDD: [03] BLE_KEY_LED (21 pins), [04] LCD_PWR (12 pins)
BLE_P0.16/LCD_BKL: [03] BLE_KEY_LED (J15.1 MOD1.D3 MOD2.10), [04] LCD_PWR (R33.2)
BLE_P0.20/LCD_A0: [03] BLE_KEY_LED (J15.5 MOD1.13 MOD2.8), [04] LCD_PWR (R24.1)
BLE_P0.21/nRESET: [03] BLE_KEY_LED (7 pins), [04] LCD_PWR (R23.1)
BLE_P0.22/LCD_nCS: [03] BLE_KEY_LED (J15.7 MOD1.C2 MOD2.4), [04] LCD_PWR (R20.1 R21.1)
BLE_P0.23/MOSI: [03] BLE_KEY_LED (J15.8 MOD1.D1 MOD2.3), [04] LCD_PWR (R26.1)
BLE_P0.25/SCLK: [03] BLE_KEY_LED (J14.2 MOD1.B1 MOD2.38), [04] LCD_PWR (R25.1)

## Assembly variants
BLE_FANSTEL: not fitted C3 C3 C18 C18 C19 C19 MOD2 MOD2 X2 X2
BLE_LAIRD: not fitted C1 C1 C12 C12 C13 C13 MOD1 MOD1 X1 X1